# EAGLE design small_button_panel (EAGLE 6.1)
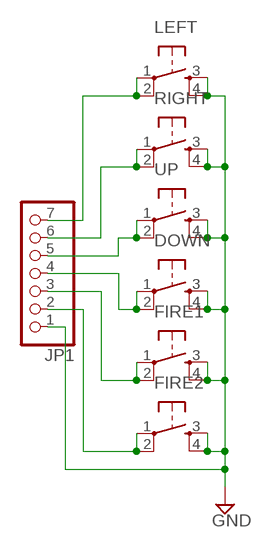
[diagram p0: schematic, sheet 1]

## Parts
DOWN  TAC_SWITCHPTH  [TACTILE-PTH]
FIRE1  TAC_SWITCHPTH  [TACTILE-PTH]
FIRE2  TAC_SWITCHPTH  [TACTILE-PTH]
JP1  PINHD-1X7  [1X07]
LEFT  TAC_SWITCHPTH  [TACTILE-PTH]
RIGHT  TAC_SWITCHPTH  [TACTILE-PTH]
UP  TAC_SWITCHPTH  [TACTILE-PTH]

## Nets
GND: DOWN.3 DOWN.4 FIRE1.3 FIRE1.4 FIRE2.3 FIRE2.4 JP1.1 LEFT.3 LEFT.4 RIGHT.3 RIGHT.4 UP.3 UP.4
N$4: JP1.7 LEFT.1 LEFT.2
N$6: JP1.5 UP.1 UP.2
N$8: FIRE2.1 FIRE2.2 JP1.2
N$9: FIRE1.1 FIRE1.2 JP1.3
N$10: DOWN.1 DOWN.2 JP1.4
RIGHT: JP1.6 RIGHT.1 RIGHT.2

## Library data of the parts
DOWN FIRE1 FIRE2 LEFT RIGHT UP = SparkFun-Electromechanical:TAC_SWITCH: Momentary Switch Button commonly used for reset or general input. Spark Fun Electronics SKU : COM-00097 SMT- SWCH-08247
JP1 = pinhead:PINHD-1X7: PIN HEADER

## Board
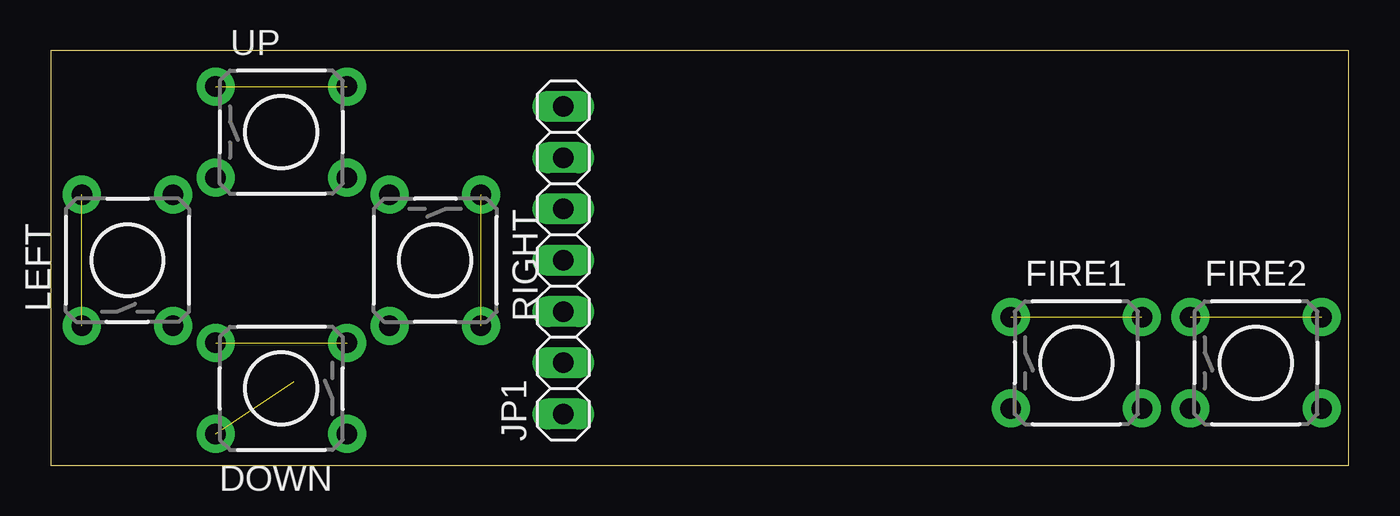
[diagram p1: board, top side]
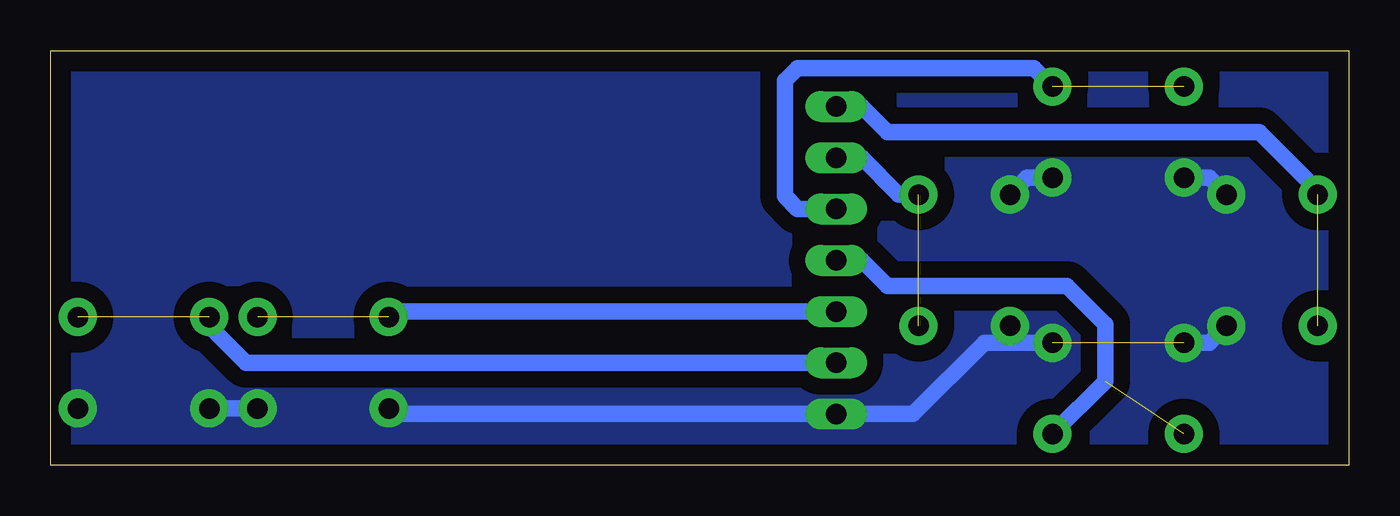
[diagram p2: board, bottom side, seen from below]

Size 64.3 x 20.55 mm. Coordinates in mm from the lower left corner, seen from the top.
Outline: 0,0 64.3,0 64.3,20.55 0,20.55 0,0
Copper layers (1*16): Top 0.035mm / dielectric 1.5mm / Bottom 0.035mm
Design rules: minimum track width 10mil, minimum drill 24mil, track to track 8mil, track to pad 8mil, pad to pad 8mil, via to via 8mil, smd to smd 8mil, copper to edge 40mil, drill to drill 8mil, minimum pad ring 10mil, minimum via ring 8mil, stop-mask expansion 4mil, vias tented up to drill 0mil, thermal gap 10mil

### Footprints (pad centres in the part's own frame; a part is rotated, then mirrored left to right if it is on the bottom)
TACTILE-PTH = drill 1.016 pad 1.88: 1 -3.251,2.261; 2 3.251,2.261; 3 -3.251,-2.261; 4 3.251,-2.261
1X07 = drill 1.016 long: 1 -7.62,0; 2 -5.08,0; 3 -2.54,0; 4 0,0; 5 2.54,0; 6 5.08,0; 7 7.62,0

### Placement (x,y rotation side)
DOWN  11.43,3.81 180 top
FIRE1  50.8,5.08 0 top
FIRE2  59.69,5.08 0 top
JP1  25.4,10.16 90 top
LEFT  3.81,10.16 90 top
RIGHT  19.05,10.16 270 top
UP  11.43,16.51 0 top

### Tracks (layer width: path | path; a pad name or v marks a point on that pad's centre or on a via)
GND  (1 unrouted)
  Bottom 0.813: UP.3 6.91,14.25 LEFT.4 | LEFT.3 6.91,6.07 DOWN.4 | UP.4 15.95,14.25 RIGHT.3 | DOWN.3 16.51,6.07 | 16.51,6.07 18.06,6.07 21.59,2.54 JP1.1 47.27,2.54 FIRE1.3 | RIGHT.4 16.79,6.35 16.51,6.07 | FIRE1.4 FIRE2.3
  pour Bottom (isolate 0.813, no thermals): 0,0 0,20.32 64.14,20.32 64.14,0
N$4  (1 unrouted)
  Bottom 0.813: LEFT.2 1.55,13.61 4.45,16.51 22.86,16.51 24.13,17.78 JP1.7
N$6  (1 unrouted)
  Bottom 0.813: JP1.5 27.3,12.7 27.94,13.34 27.94,19.05 27.3,19.68 15.6,19.68 UP.2
N$8  (1 unrouted)
  Bottom 0.813: JP1.2 54.61,5.08 56.44,6.91 FIRE2.1
N$9  (1 unrouted)
  Bottom 0.813: JP1.3 47.27,7.62 FIRE1.1
N$10  (1 unrouted)
  Bottom 0.813: JP1.4 24.13,10.16 22.86,8.89 13.97,8.89 12.06,6.99 12.06,4.17 DOWN.1
RIGHT  (1 unrouted)
  Bottom 0.813: RIGHT.1 22.3,13.41 24.13,15.24 JP1.6